# Altium schematic sheet MAZ000185 - Diagrama eléctrico.SchDoc: MAZ000185 - Diagrama eléctrico
size A; ApprovedBy: Christian Ledwidth; CheckedBy: Nahuel Martinez; Author: Santiago Marti; CompanyName: Body Health; DrawnBy: Santiago Marti; Revision: A; SheetNumber: 1; SheetTotal: 2
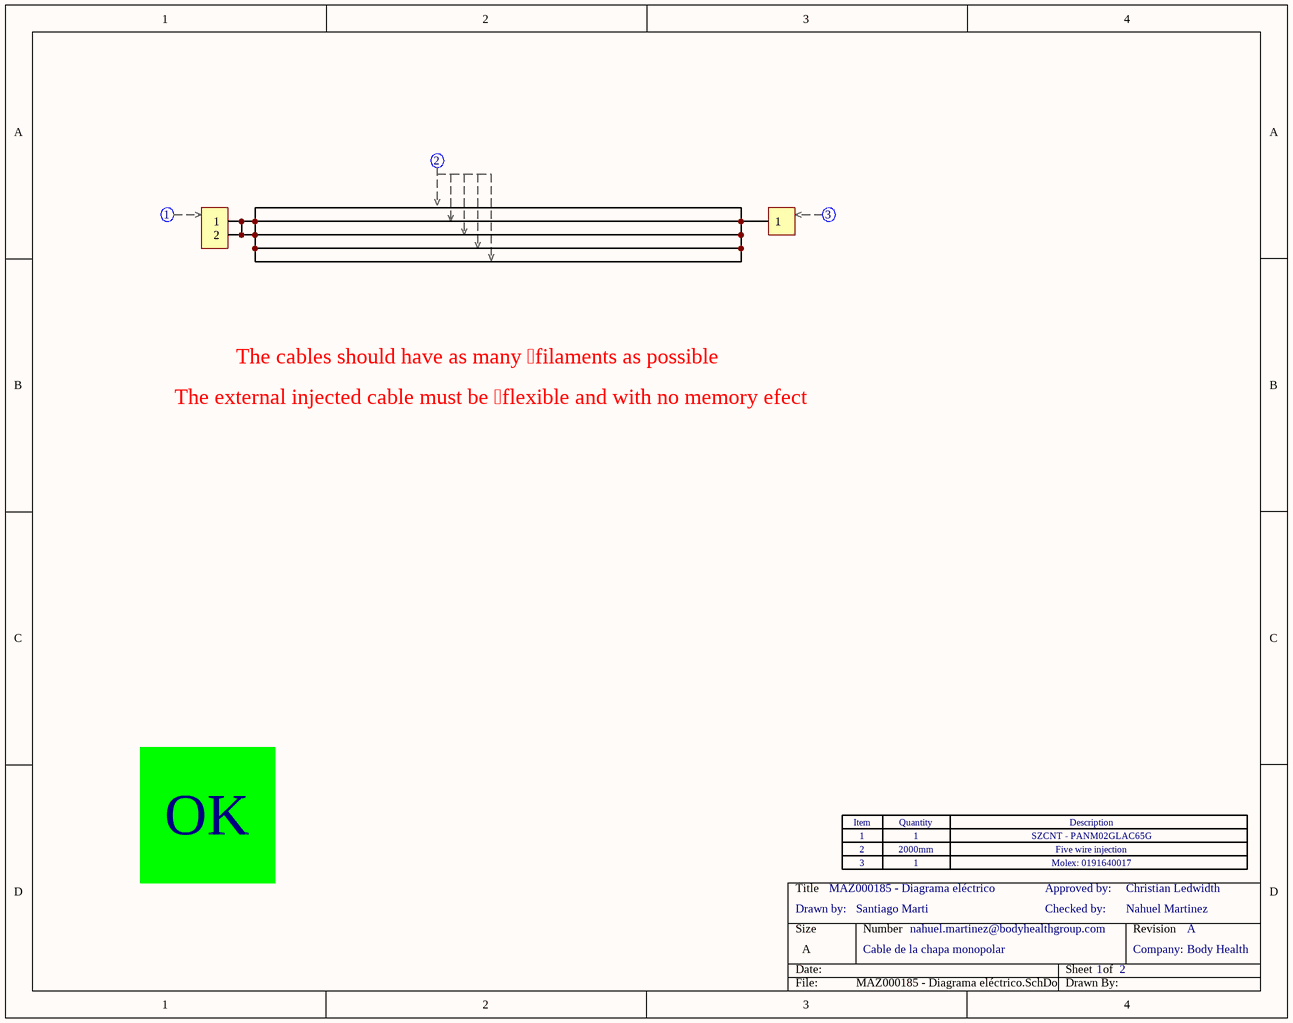
[diagram p0: MAZ000185 - Diagrama eléctrico.SchDoc]

## Parts
(Parts that share a designator on the sheet are numbered #1, #2 ... from top to bottom, then left to right.)
Con?  Shovel  (value not drawn)  (part D of 4)
Conn2  SZCNT_07_Macho  (value not drawn)  (part B of 3)
Conn9  SZCNT_07_Macho  (value not drawn)  (part B of 3)
Conn?#1  SZCNT_07_Macho  (value not drawn)  (part B of 3)
Conn?#2  SZCNT_02_Macho  (value not drawn)  (part C of 3)
Zoc1  Zócalo_Header  (value not drawn)
Zoc2  Zócalo_Item  (value not drawn)
Zoc3  Zócalo_Item  (value not drawn)
Zoc9  Zócalo_Item  (value not drawn)

## Nets
NetCon?_1: Con?.1 Conn?#2.1 Conn?#2.2

## Notes on the sheet
- The cables should have as many filaments as possible
- The external injected cable must be flexible and with no memory efect
- OK
- 1
- SZCNT - PANM02GLAC65G
- Drawn by:
- 2
- 3
- 2000mm
- Checked by:
- Approved by:
- Five wire injection
- Molex: 0191640017
- Cable de la chapa monopolar
- nahuel.martinez@bodyhealthgroup.com
- Company:
- (in symbol Zócalo_Header) Item; Quantity; Description

## Library data of the parts
Con? = Shovel: CONN HOUSING SHOVEL M4; Cod.DigiKey: -; Cod.Fabricante: -; ComponentLink1Description: Manufacturer Link; ComponentLink1URL: -; DIGIKEYx50: -; Fabricante: -; CallOut: *; DIGIKEYx100: -
Conn2 = SZCNT_07_Macho: Conector SZCNT 7 vías macho para cable; CallOut: 2; Cod.DigiKey: Se compra a SZCNT; Cod.Fabricante: *; ComponentLink1Description: Manufacturer Link; ComponentLink1URL: *; DIGIKEYx100: *; Fabricante: SZCNT; DIGIKEYx50: *
Conn9 = SZCNT_07_Macho: Conector SZCNT 7 vías macho para cable; CallOut: 1; Cod.DigiKey: Se compra a SZCNT; Cod.Fabricante: *; ComponentLink1Description: Manufacturer Link; ComponentLink1URL: *; DIGIKEYx100: *; Fabricante: SZCNT; DIGIKEYx50: *
Conn?#1 = SZCNT_07_Macho: Conector SZCNT 7 vías macho para cable; CallOut: 3; Cod.DigiKey: Se compra a SZCNT; Cod.Fabricante: *; ComponentLink1Description: Manufacturer Link; ComponentLink1URL: *; DIGIKEYx100: *; Fabricante: SZCNT; DIGIKEYx50: *
Conn?#2 = SZCNT_02_Macho: Conector SZCNT 2 vías macho para cable; Cod.DigiKey: Se compra a SZCNT; Cod.Fabricante: *; ComponentLink1Description: Manufacturer Link; ComponentLink1URL: *; DIGIKEYx100: *; Fabricante: SZCNT; CallOut: *; DIGIKEYx50: *
Zoc1 = Zócalo_Header: Header para el zócalo de referencias
Zoc2 Zoc3 Zoc9 = Zócalo_Item: Ítem para el zócalo de referencias; Desginator: *; Quantity: *; ItemDescription: *